# Altium schematic sheet TopPCB.SchDoc
size A4; Organization: Microprocessor-Design Pty Ltd; Address1: 18/110 Caroline Street; Address2: South Yarra; Address3: VIC 3141; Address4: Australia; DocumentNumber: 1; SheetNumber: 1; SheetTotal: 4
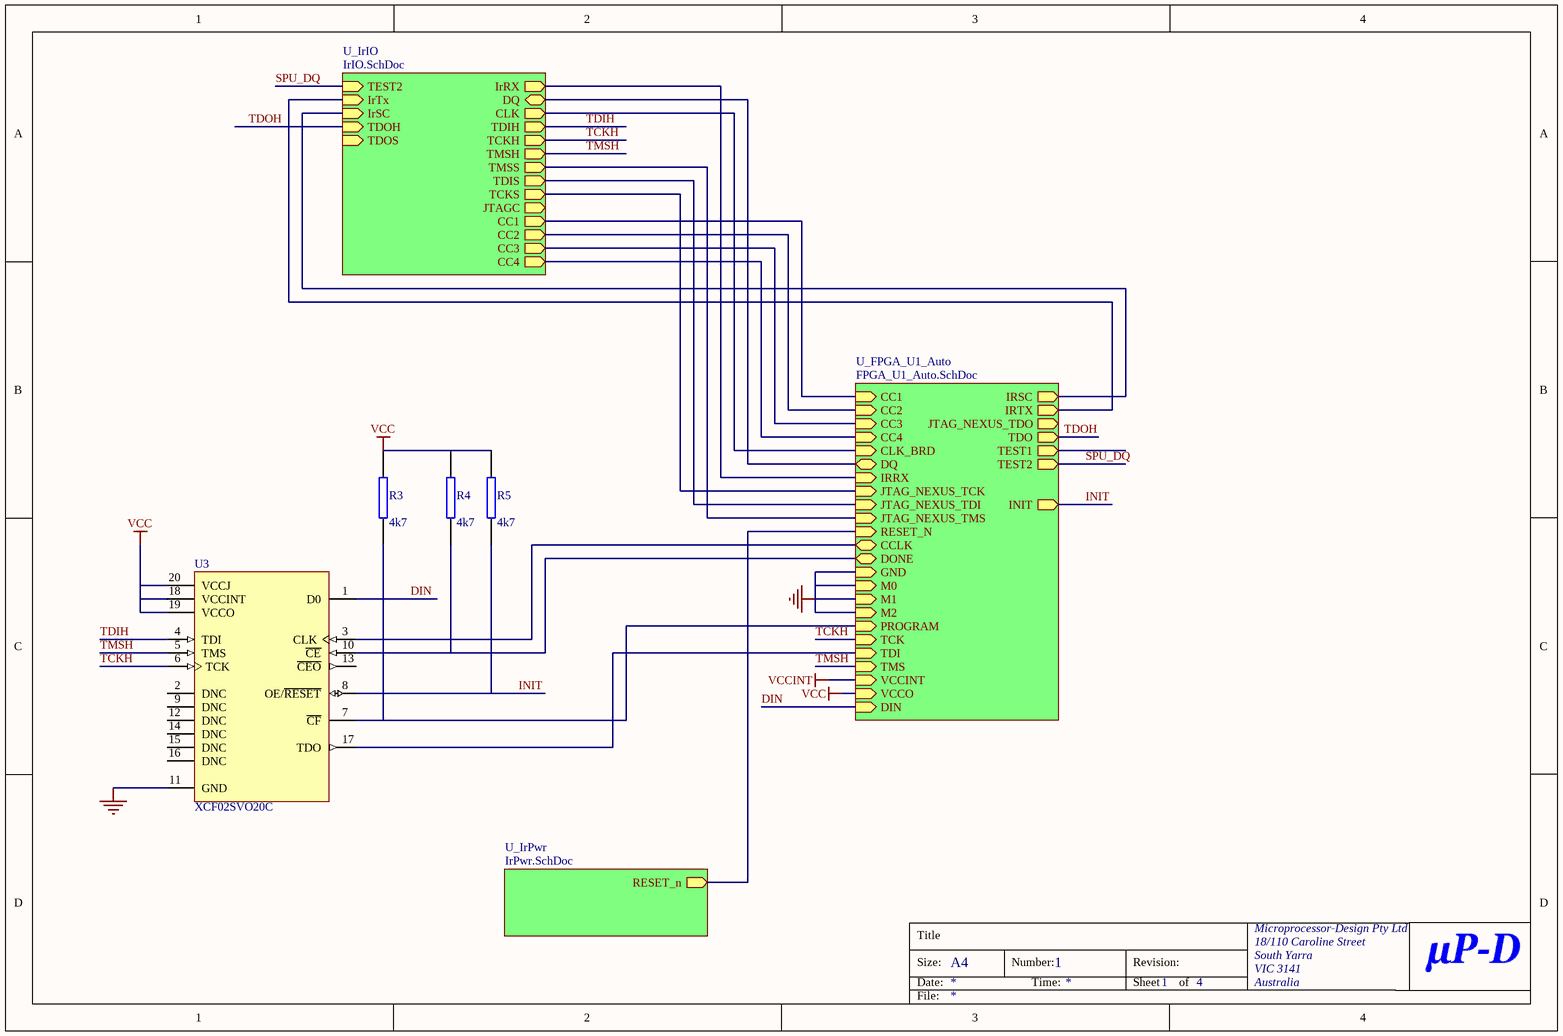
[diagram p0: TopPCB.SchDoc]

## Parts
R3  4k7  [M0603]
R4  4k7  [M0603]
R5  4k7  [M0603]
U3  XCF02SVO20C  [VO20]

## Sub-sheets
U_FPGA_U1_Auto = FPGA_U1_Auto.SchDoc: CC1 (in), CC2 (in), CC3 (in), CC4 (in), CLK_BRD (in), DIN (in), DQ (bidir), INIT (out), IRRX (in), IRSC (out), IRTX (out), JTAG_NEXUS_TCK (in), JTAG_NEXUS_TDI (in), JTAG_NEXUS_TDO (out), JTAG_NEXUS_TMS (in), RESET_N (in), TEST1 (out), TEST2 (out), CCLK (bidir), DONE (bidir), GND (in), M0 (in), M1 (in), M2 (in), PROGRAM (in), TCK (in), TDI (in), TDO (out), TMS (in), VCCINT (in), VCCO (in)
U_IrIO = IrIO.SchDoc: IrRX (out), DQ (bidir), TEST2 (in), IrTx (in), CLK (out), IrSC (in), TDIH (out), TCKH (out), TDOH (in), TMSH (out), TMSS (out), TDOS (in), TDIS (out), TCKS (out), JTAGC (out), CC1 (out), CC2 (out), CC3 (out), CC4 (out)
U_IrPwr = IrPwr.SchDoc: RESET_n (out)

## Nets
GND: U3.11(GND) ; sheet U_FPGA_U1_Auto/GND, sheet U_FPGA_U1_Auto/M0, sheet U_FPGA_U1_Auto/M1, sheet U_FPGA_U1_Auto/M2
VCC: R3.2 R4.2 R5.2 U3.18(VCCINT) U3.19(VCCO) U3.20(VCCJ) ; sheet U_FPGA_U1_Auto/VCCO
VCCINT: sheet U_FPGA_U1_Auto/VCCINT
DIN: U3.1(D0) ; sheet U_FPGA_U1_Auto/DIN
INIT: R5.1 U3.8(OE/~{RESET}) ; sheet U_FPGA_U1_Auto/INIT
SPU_DQ: sheet U_IrIO/TEST2, sheet U_FPGA_U1_Auto/TEST2
TCKH: U3.6(TCK) ; sheet U_IrIO/TCKH, sheet U_FPGA_U1_Auto/TCK
TDIH: U3.4(TDI) ; sheet U_IrIO/TDIH
TDOH: sheet U_IrIO/TDOH, sheet U_FPGA_U1_Auto/TDO
TMSH: U3.5(TMS) ; sheet U_IrIO/TMSH, sheet U_FPGA_U1_Auto/TMS
NetR3_1: R3.1 U3.7(~{CF}) ; sheet U_FPGA_U1_Auto/PROGRAM
NetR4_1: R4.1 U3.10(~{CE}) ; sheet U_FPGA_U1_Auto/DONE
NetU3_3: U3.3(CLK) ; sheet U_FPGA_U1_Auto/CCLK
NetU3_17: U3.17(TDO) ; sheet U_FPGA_U1_Auto/TDI
(unnamed): sheet U_IrIO/IrRX, sheet U_FPGA_U1_Auto/IRRX
(unnamed): sheet U_IrIO/DQ, sheet U_FPGA_U1_Auto/DQ
(unnamed): sheet U_IrIO/IrTx, sheet U_FPGA_U1_Auto/IRTX
(unnamed): sheet U_IrIO/CLK, sheet U_FPGA_U1_Auto/CLK_BRD
(unnamed): sheet U_IrIO/IrSC, sheet U_FPGA_U1_Auto/IRSC
(unnamed): sheet U_IrIO/TMSS, sheet U_FPGA_U1_Auto/JTAG_NEXUS_TMS
(unnamed): sheet U_IrIO/TDIS, sheet U_FPGA_U1_Auto/JTAG_NEXUS_TDI
(unnamed): sheet U_IrIO/TCKS, sheet U_FPGA_U1_Auto/JTAG_NEXUS_TCK
(unnamed): sheet U_IrIO/CC1, sheet U_FPGA_U1_Auto/CC1
(unnamed): sheet U_IrIO/CC2, sheet U_FPGA_U1_Auto/CC2
(unnamed): sheet U_IrIO/CC3, sheet U_FPGA_U1_Auto/CC3
(unnamed): sheet U_IrIO/CC4, sheet U_FPGA_U1_Auto/CC4
(unnamed): sheet U_IrPwr/RESET_n, sheet U_FPGA_U1_Auto/RESET_N

Not connected (* = marked no-connect by the designer): U3 2(DNC) 9(DNC) 12(DNC) 13(~{CEO}) 14(DNC) 15(DNC) 16(DNC)

## Notes on the sheet
- Title
- Size:
- Date:
- A4
- Number:
- Time:
- Revision:
- Sheet
- of
- File:

## Library data of the parts
R3-R5 = RES: SMT RESISTOR
U3 = XCF02SVO20C: XCF00S Series, Platform Flash In-System Programmable Configuration 3.3V PROM, 20-Pin TSOP, 2-Megabit, Commercial Grade; Manufacturer: Xilinx; Package Information: Latest Revision: ver1.0, May-2003; Code - JEDEC: MO-153-AC; Published: 17-Sep-2003; Datasheet: Latest Revision: ver1.1, Jun-2003; Package Reference: VO20; Publisher: Altium Limited